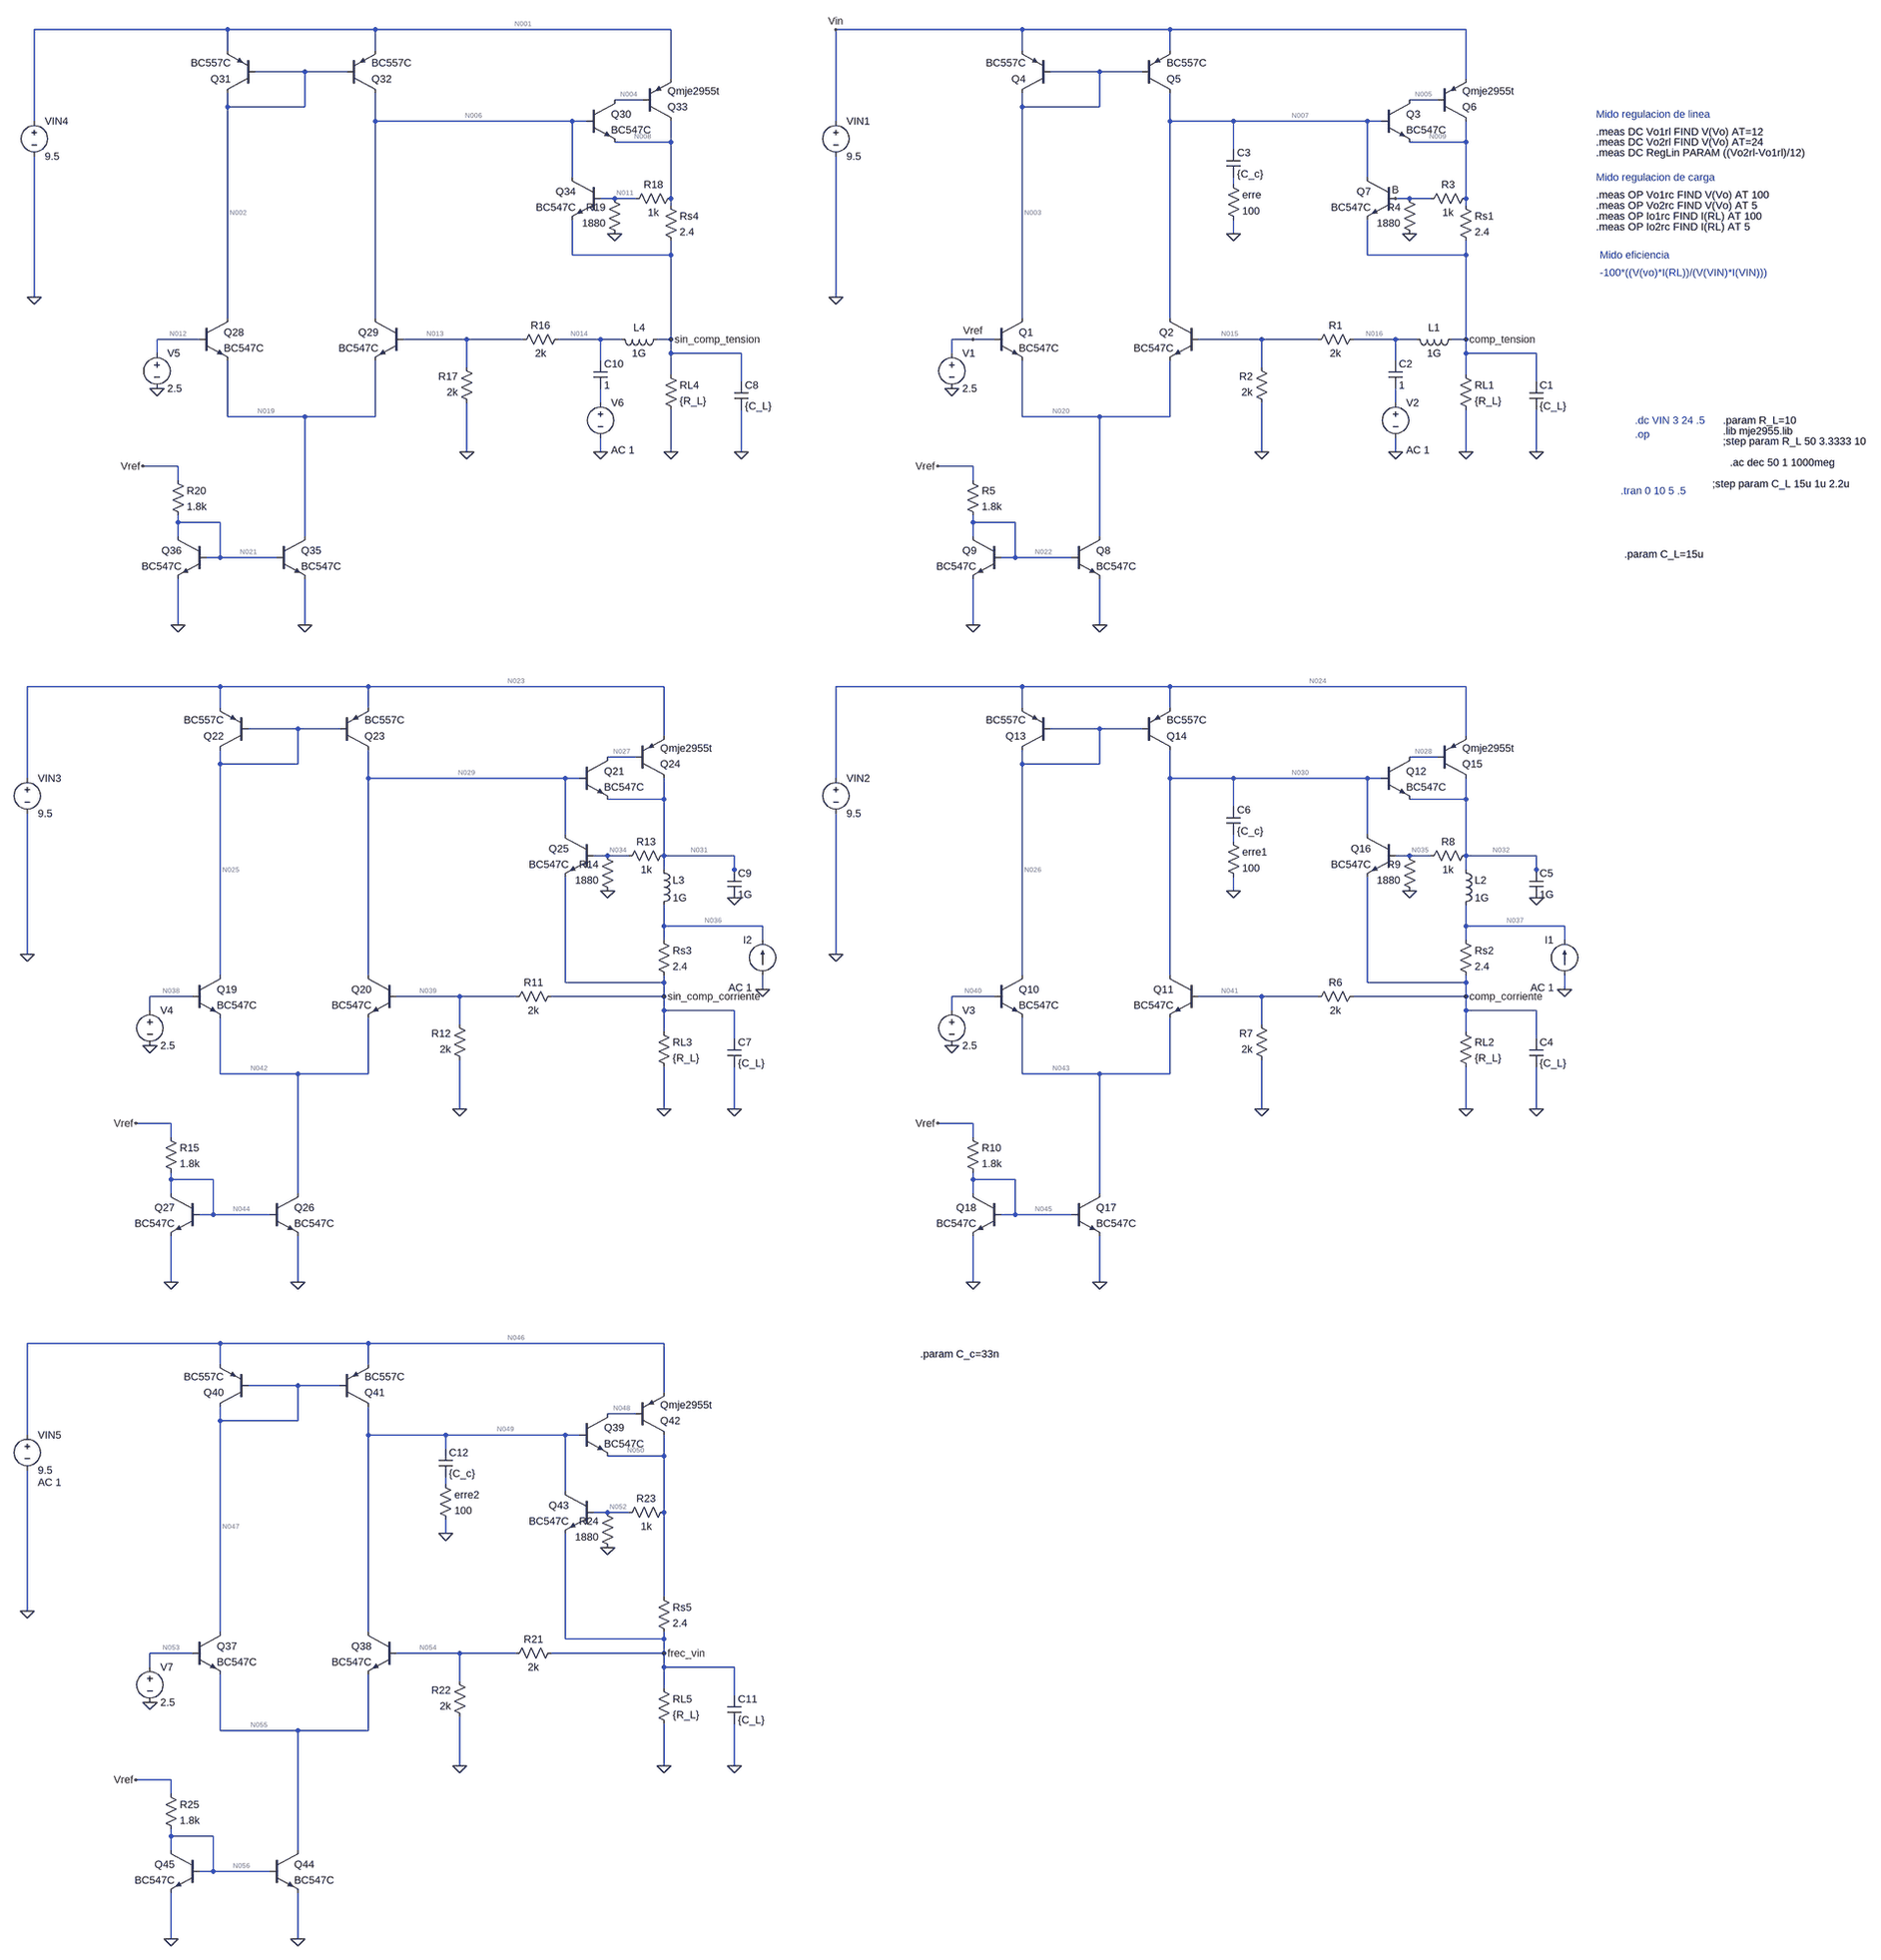
[diagram p0: schematic segundo_check_2.asc]
segundo_check_2.asc, the LTspice schematic file:
Version 4.1
SHEET 1 3652 4180
WIRE -2576 -384 -3088 -384
WIRE -2240 -384 -2576 -384
WIRE -1568 -384 -2240 -384
WIRE -528 -384 -1040 -384
WIRE -192 -384 -528 -384
WIRE 480 -384 -192 -384
WIRE -2576 -336 -2576 -384
WIRE -2240 -336 -2240 -384
WIRE -528 -336 -528 -384
WIRE -192 -336 -192 -384
WIRE -2400 -288 -2512 -288
WIRE -2304 -288 -2400 -288
WIRE -352 -288 -464 -288
WIRE -256 -288 -352 -288
WIRE -1568 -272 -1568 -384
WIRE 480 -272 480 -384
WIRE -1632 -224 -1696 -224
WIRE 416 -224 352 -224
WIRE -2576 -208 -2576 -240
WIRE -2400 -208 -2400 -288
WIRE -2400 -208 -2576 -208
WIRE -528 -208 -528 -240
WIRE -352 -208 -352 -288
WIRE -352 -208 -528 -208
WIRE -3088 -176 -3088 -384
WIRE -2240 -176 -2240 -240
WIRE -1792 -176 -2240 -176
WIRE -1760 -176 -1792 -176
WIRE -1040 -176 -1040 -384
WIRE -192 -176 -192 -240
WIRE -48 -176 -192 -176
WIRE 256 -176 -48 -176
WIRE 288 -176 256 -176
WIRE -1568 -128 -1568 -176
WIRE -1568 -128 -1696 -128
WIRE 480 -128 480 -176
WIRE 480 -128 352 -128
WIRE -48 -112 -48 -176
WIRE -1792 -48 -1792 -176
WIRE 256 -48 256 -176
WIRE -48 -32 -48 -48
WIRE -1696 0 -1728 0
WIRE -1648 0 -1696 0
WIRE -1568 0 -1568 -128
WIRE 352 0 320 0
WIRE 400 0 352 0
WIRE 480 0 480 -128
WIRE -1568 16 -1568 0
WIRE 480 16 480 0
WIRE -48 80 -48 48
WIRE -1792 128 -1792 48
WIRE -1568 128 -1568 96
WIRE -1568 128 -1792 128
WIRE 256 128 256 48
WIRE 480 128 480 96
WIRE 480 128 256 128
WIRE -3088 224 -3088 -96
WIRE -1040 224 -1040 -96
WIRE -2576 272 -2576 -208
WIRE -2240 272 -2240 -176
WIRE -528 272 -528 -208
WIRE -192 272 -192 -176
WIRE -2640 320 -2736 320
WIRE -2032 320 -2176 320
WIRE -1904 320 -2032 320
WIRE -1728 320 -1824 320
WIRE -1680 320 -1728 320
WIRE -1568 320 -1568 128
WIRE -1568 320 -1600 320
WIRE -640 320 -688 320
WIRE -592 320 -640 320
WIRE 16 320 -128 320
WIRE 144 320 16 320
WIRE 320 320 224 320
WIRE 368 320 320 320
WIRE 480 320 480 128
WIRE 480 320 448 320
WIRE -2736 352 -2736 320
WIRE -1568 352 -1568 320
WIRE -1408 352 -1568 352
WIRE -688 352 -688 320
WIRE 480 352 480 320
WIRE 640 352 480 352
WIRE -1728 368 -1728 320
WIRE 320 368 320 320
WIRE -2032 384 -2032 320
WIRE 16 384 16 320
WIRE -1568 400 -1568 352
WIRE 480 400 480 352
WIRE -1408 416 -1408 352
WIRE 640 416 640 352
WIRE -1728 464 -1728 432
WIRE 320 464 320 432
WIRE -2576 496 -2576 368
WIRE -2400 496 -2576 496
WIRE -2240 496 -2240 368
WIRE -2240 496 -2400 496
WIRE -528 496 -528 368
WIRE -352 496 -528 496
WIRE -192 496 -192 368
WIRE -192 496 -352 496
WIRE -2032 576 -2032 464
WIRE -1728 576 -1728 544
WIRE -1568 576 -1568 480
WIRE -1408 576 -1408 480
WIRE 16 576 16 464
WIRE 320 576 320 544
WIRE 480 576 480 480
WIRE 640 576 640 480
WIRE -2688 608 -2768 608
WIRE -640 608 -720 608
WIRE -2688 640 -2688 608
WIRE -640 640 -640 608
WIRE -2688 736 -2688 720
WIRE -2592 736 -2688 736
WIRE -640 736 -640 720
WIRE -544 736 -640 736
WIRE -2688 768 -2688 736
WIRE -2400 768 -2400 496
WIRE -640 768 -640 736
WIRE -352 768 -352 496
WIRE -2592 816 -2592 736
WIRE -2592 816 -2624 816
WIRE -2464 816 -2592 816
WIRE -544 816 -544 736
WIRE -544 816 -576 816
WIRE -416 816 -544 816
WIRE -2688 976 -2688 864
WIRE -2400 976 -2400 864
WIRE -640 976 -640 864
WIRE -352 976 -352 864
WIRE -2592 1216 -3104 1216
WIRE -2256 1216 -2592 1216
WIRE -1584 1216 -2256 1216
WIRE -528 1216 -1040 1216
WIRE -192 1216 -528 1216
WIRE 480 1216 -192 1216
WIRE -2592 1264 -2592 1216
WIRE -2256 1264 -2256 1216
WIRE -528 1264 -528 1216
WIRE -192 1264 -192 1216
WIRE -2416 1312 -2528 1312
WIRE -2320 1312 -2416 1312
WIRE -352 1312 -464 1312
WIRE -256 1312 -352 1312
WIRE -1584 1328 -1584 1216
WIRE 480 1328 480 1216
WIRE -1648 1376 -1712 1376
WIRE 416 1376 352 1376
WIRE -2592 1392 -2592 1360
WIRE -2416 1392 -2416 1312
WIRE -2416 1392 -2592 1392
WIRE -528 1392 -528 1360
WIRE -352 1392 -352 1312
WIRE -352 1392 -528 1392
WIRE -3104 1424 -3104 1216
WIRE -2256 1424 -2256 1360
WIRE -1808 1424 -2256 1424
WIRE -1776 1424 -1808 1424
WIRE -1040 1424 -1040 1216
WIRE -192 1424 -192 1360
WIRE -48 1424 -192 1424
WIRE 256 1424 -48 1424
WIRE 288 1424 256 1424
WIRE -1584 1472 -1584 1424
WIRE -1584 1472 -1712 1472
WIRE 480 1472 480 1424
WIRE 480 1472 352 1472
WIRE -48 1488 -48 1424
WIRE -1808 1552 -1808 1424
WIRE 256 1552 256 1424
WIRE -48 1568 -48 1552
WIRE -1712 1600 -1744 1600
WIRE -1664 1600 -1712 1600
WIRE -1584 1600 -1584 1472
WIRE -1424 1600 -1584 1600
WIRE 352 1600 320 1600
WIRE 400 1600 352 1600
WIRE 480 1600 480 1472
WIRE 640 1600 480 1600
WIRE -1584 1632 -1584 1600
WIRE -1424 1632 -1424 1600
WIRE 480 1632 480 1600
WIRE 640 1632 640 1600
WIRE -1424 1648 -1424 1632
WIRE 640 1648 640 1632
WIRE -48 1680 -48 1648
WIRE -1584 1760 -1584 1712
WIRE -1360 1760 -1584 1760
WIRE 480 1760 480 1712
WIRE 704 1760 480 1760
WIRE -1584 1792 -1584 1760
WIRE -1360 1792 -1360 1760
WIRE 480 1792 480 1760
WIRE 704 1792 704 1760
WIRE -3104 1824 -3104 1504
WIRE -1040 1824 -1040 1504
WIRE -2592 1872 -2592 1392
WIRE -2256 1872 -2256 1424
WIRE -528 1872 -528 1392
WIRE -192 1872 -192 1424
WIRE -1808 1888 -1808 1648
WIRE -1584 1888 -1584 1872
WIRE -1584 1888 -1808 1888
WIRE 256 1888 256 1648
WIRE 480 1888 480 1872
WIRE 480 1888 256 1888
WIRE -1360 1904 -1360 1872
WIRE 704 1904 704 1872
WIRE -2656 1920 -2752 1920
WIRE -2048 1920 -2192 1920
WIRE -1920 1920 -2048 1920
WIRE -1584 1920 -1584 1888
WIRE -1584 1920 -1840 1920
WIRE -592 1920 -688 1920
WIRE 16 1920 -128 1920
WIRE 144 1920 16 1920
WIRE 480 1920 480 1888
WIRE 480 1920 224 1920
WIRE -2752 1952 -2752 1920
WIRE -1584 1952 -1584 1920
WIRE -1424 1952 -1584 1952
WIRE -688 1952 -688 1920
WIRE 480 1952 480 1920
WIRE 640 1952 480 1952
WIRE -2048 1984 -2048 1920
WIRE 16 1984 16 1920
WIRE -1584 2000 -1584 1952
WIRE 480 2000 480 1952
WIRE -1424 2016 -1424 1952
WIRE 640 2016 640 1952
WIRE -2592 2096 -2592 1968
WIRE -2416 2096 -2592 2096
WIRE -2256 2096 -2256 1968
WIRE -2256 2096 -2416 2096
WIRE -528 2096 -528 1968
WIRE -352 2096 -528 2096
WIRE -192 2096 -192 1968
WIRE -192 2096 -352 2096
WIRE -2048 2176 -2048 2064
WIRE -1584 2176 -1584 2080
WIRE -1424 2176 -1424 2080
WIRE 16 2176 16 2064
WIRE 480 2176 480 2080
WIRE 640 2176 640 2080
WIRE -2704 2208 -2784 2208
WIRE -640 2208 -720 2208
WIRE -2704 2240 -2704 2208
WIRE -640 2240 -640 2208
WIRE -2704 2336 -2704 2320
WIRE -2608 2336 -2704 2336
WIRE -640 2336 -640 2320
WIRE -544 2336 -640 2336
WIRE -2704 2368 -2704 2336
WIRE -2416 2368 -2416 2096
WIRE -640 2368 -640 2336
WIRE -352 2368 -352 2096
WIRE -2608 2416 -2608 2336
WIRE -2608 2416 -2640 2416
WIRE -2480 2416 -2608 2416
WIRE -544 2416 -544 2336
WIRE -544 2416 -576 2416
WIRE -416 2416 -544 2416
WIRE -2704 2576 -2704 2464
WIRE -2416 2576 -2416 2464
WIRE -640 2576 -640 2464
WIRE -352 2576 -352 2464
WIRE -2592 2800 -3104 2800
WIRE -2256 2800 -2592 2800
WIRE -1584 2800 -2256 2800
WIRE -2592 2848 -2592 2800
WIRE -2256 2848 -2256 2800
WIRE -2416 2896 -2528 2896
WIRE -2320 2896 -2416 2896
WIRE -1584 2912 -1584 2800
WIRE -1648 2960 -1712 2960
WIRE -2592 2976 -2592 2944
WIRE -2416 2976 -2416 2896
WIRE -2416 2976 -2592 2976
WIRE -3104 3008 -3104 2800
WIRE -2256 3008 -2256 2944
WIRE -2080 3008 -2256 3008
WIRE -1808 3008 -2080 3008
WIRE -1776 3008 -1808 3008
WIRE -2080 3040 -2080 3008
WIRE -1584 3056 -1584 3008
WIRE -1584 3056 -1712 3056
WIRE -2080 3120 -2080 3104
WIRE -1808 3136 -1808 3008
WIRE -1712 3184 -1744 3184
WIRE -1664 3184 -1712 3184
WIRE -1584 3184 -1584 3056
WIRE -2080 3232 -2080 3200
WIRE -1584 3376 -1584 3184
WIRE -3104 3408 -3104 3088
WIRE -2592 3456 -2592 2976
WIRE -2256 3456 -2256 3008
WIRE -1808 3472 -1808 3232
WIRE -1584 3472 -1584 3456
WIRE -1584 3472 -1808 3472
WIRE -2656 3504 -2752 3504
WIRE -2048 3504 -2192 3504
WIRE -1920 3504 -2048 3504
WIRE -1584 3504 -1584 3472
WIRE -1584 3504 -1840 3504
WIRE -2752 3536 -2752 3504
WIRE -1584 3536 -1584 3504
WIRE -1424 3536 -1584 3536
WIRE -2048 3568 -2048 3504
WIRE -1584 3584 -1584 3536
WIRE -1424 3600 -1424 3536
WIRE -2592 3680 -2592 3552
WIRE -2416 3680 -2592 3680
WIRE -2256 3680 -2256 3552
WIRE -2256 3680 -2416 3680
WIRE -2048 3760 -2048 3648
WIRE -1584 3760 -1584 3664
WIRE -1424 3760 -1424 3664
WIRE -2704 3792 -2784 3792
WIRE -2704 3824 -2704 3792
WIRE -2704 3920 -2704 3904
WIRE -2608 3920 -2704 3920
WIRE -2704 3952 -2704 3920
WIRE -2416 3952 -2416 3680
WIRE -2608 4000 -2608 3920
WIRE -2608 4000 -2640 4000
WIRE -2480 4000 -2608 4000
WIRE -2704 4160 -2704 4048
WIRE -2416 4160 -2416 4048
FLAG -688 432 0
FLAG 480 576 0
FLAG -1040 224 0
FLAG 16 576 0
FLAG 352 80 0
FLAG 320 0 B
FLAG -640 320 Vref
FLAG -352 976 0
FLAG -1040 -384 Vin
FLAG -640 976 0
FLAG -720 608 Vref
FLAG 640 576 0
FLAG 320 576 0
FLAG -48 80 0
FLAG -688 2032 0
FLAG 480 2176 0
FLAG -1040 1824 0
FLAG 16 2176 0
FLAG 352 1680 0
FLAG -352 2576 0
FLAG -640 2576 0
FLAG -720 2208 Vref
FLAG 640 2176 0
FLAG 704 1904 0
FLAG -48 1680 0
FLAG 640 1696 0
FLAG -2752 2032 0
FLAG -1584 2176 0
FLAG -3104 1824 0
FLAG -2048 2176 0
FLAG -1712 1680 0
FLAG -2416 2576 0
FLAG -2704 2576 0
FLAG -2784 2208 Vref
FLAG -1424 2176 0
FLAG -1360 1904 0
FLAG -1424 1696 0
FLAG -2736 432 0
FLAG -1568 576 0
FLAG -3088 224 0
FLAG -2032 576 0
FLAG -1696 80 0
FLAG -2400 976 0
FLAG -2688 976 0
FLAG -2768 608 Vref
FLAG -1408 576 0
FLAG -1728 576 0
FLAG -1568 320 sin_comp_tension
FLAG 480 320 comp_tension
FLAG -1584 1920 sin_comp_corriente
FLAG 480 1920 comp_corriente
FLAG -2752 3616 0
FLAG -1584 3760 0
FLAG -3104 3408 0
FLAG -2048 3760 0
FLAG -1712 3264 0
FLAG -2416 4160 0
FLAG -2704 4160 0
FLAG -2784 3792 Vref
FLAG -1424 3760 0
FLAG -1584 3504 frec_vin
FLAG -2080 3232 0
SYMBOL npn -592 272 R0
SYMATTR InstName Q1
SYMATTR Value BC547C
SYMBOL npn -128 272 M0
SYMATTR InstName Q2
SYMATTR Value BC547C
SYMBOL npn 288 -224 R0
SYMATTR InstName Q3
SYMATTR Value BC547C
SYMBOL pnp -464 -240 R180
SYMATTR InstName Q4
SYMATTR Value BC557C
SYMBOL pnp -256 -240 M180
SYMATTR InstName Q5
SYMATTR Value BC557C
SYMBOL voltage -688 336 R0
WINDOW 123 24 124 Left 2
WINDOW 39 0 0 Left 0
SYMATTR InstName V1
SYMATTR Value 2.5
SYMBOL voltage -1040 -192 R0
WINDOW 123 0 0 Left 0
WINDOW 39 0 0 Left 0
SYMATTR InstName VIN1
SYMATTR Value 9.5
SYMBOL pnp 416 -176 M180
SYMATTR InstName Q6
SYMATTR Value Qmje2955t
SYMBOL res 464 384 R0
SYMATTR InstName RL1
SYMATTR Value {R_L}
SYMBOL res 240 304 R90
WINDOW 0 0 56 VBottom 2
WINDOW 3 32 56 VTop 2
SYMATTR InstName R1
SYMATTR Value 2k
SYMBOL res 32 480 R180
WINDOW 0 36 76 Left 2
WINDOW 3 36 40 Left 2
SYMATTR InstName R2
SYMATTR Value 2k
SYMBOL npn 320 -48 M0
SYMATTR InstName Q7
SYMATTR Value BC547C
SYMBOL res 464 0 R0
SYMATTR InstName Rs1
SYMATTR Value 2.4
SYMBOL res 496 -16 R90
WINDOW 0 0 56 VBottom 2
WINDOW 3 32 56 VTop 2
SYMATTR InstName R3
SYMATTR Value 1k
SYMBOL res 368 96 R180
WINDOW 0 36 76 Left 2
WINDOW 3 36 40 Left 2
SYMATTR InstName R4
SYMATTR Value 1880
SYMBOL npn -416 768 R0
SYMATTR InstName Q8
SYMATTR Value BC547C
SYMBOL npn -576 768 M0
SYMATTR InstName Q9
SYMATTR Value BC547C
SYMBOL res -656 624 R0
SYMATTR InstName R5
SYMATTR Value 1.8k
SYMBOL cap 624 416 R0
SYMATTR InstName C1
SYMATTR Value {C_L}
SYMBOL ind 464 304 R90
WINDOW 0 5 56 VBottom 2
WINDOW 3 32 56 VTop 2
SYMATTR InstName L1
SYMATTR Value 1G
SYMBOL cap 304 368 R0
SYMATTR InstName C2
SYMATTR Value 1
SYMBOL voltage 320 448 R0
WINDOW 123 24 124 Left 2
WINDOW 39 0 0 Left 0
SYMATTR Value2 AC 1
SYMATTR InstName V2
SYMATTR Value ""
SYMBOL cap -64 -112 R0
SYMATTR InstName C3
SYMATTR Value {C_c}
SYMBOL res -64 -48 R0
SYMATTR InstName erre
SYMATTR Value 100
SYMBOL npn -592 1872 R0
SYMATTR InstName Q10
SYMATTR Value BC547C
SYMBOL npn -128 1872 M0
SYMATTR InstName Q11
SYMATTR Value BC547C
SYMBOL npn 288 1376 R0
SYMATTR InstName Q12
SYMATTR Value BC547C
SYMBOL pnp -464 1360 R180
SYMATTR InstName Q13
SYMATTR Value BC557C
SYMBOL pnp -256 1360 M180
SYMATTR InstName Q14
SYMATTR Value BC557C
SYMBOL voltage -688 1936 R0
WINDOW 123 24 124 Left 2
WINDOW 39 0 0 Left 0
SYMATTR InstName V3
SYMATTR Value 2.5
SYMBOL voltage -1040 1408 R0
WINDOW 123 0 0 Left 0
WINDOW 39 0 0 Left 0
SYMATTR InstName VIN2
SYMATTR Value 9.5
SYMBOL pnp 416 1424 M180
SYMATTR InstName Q15
SYMATTR Value Qmje2955t
SYMBOL res 464 1984 R0
SYMATTR InstName RL2
SYMATTR Value {R_L}
SYMBOL res 240 1904 R90
WINDOW 0 0 56 VBottom 2
WINDOW 3 32 56 VTop 2
SYMATTR InstName R6
SYMATTR Value 2k
SYMBOL res 32 2080 R180
WINDOW 0 36 76 Left 2
WINDOW 3 36 40 Left 2
SYMATTR InstName R7
SYMATTR Value 2k
SYMBOL npn 320 1552 M0
SYMATTR InstName Q16
SYMATTR Value BC547C
SYMBOL res 464 1776 R0
SYMATTR InstName Rs2
SYMATTR Value 2.4
SYMBOL res 496 1584 R90
WINDOW 0 0 56 VBottom 2
WINDOW 3 32 56 VTop 2
SYMATTR InstName R8
SYMATTR Value 1k
SYMBOL res 368 1696 R180
WINDOW 0 36 76 Left 2
WINDOW 3 36 40 Left 2
SYMATTR InstName R9
SYMATTR Value 1880
SYMBOL npn -416 2368 R0
SYMATTR InstName Q17
SYMATTR Value BC547C
SYMBOL npn -576 2368 M0
SYMATTR InstName Q18
SYMATTR Value BC547C
SYMBOL res -656 2224 R0
SYMATTR InstName R10
SYMATTR Value 1.8k
SYMBOL cap 624 2016 R0
SYMATTR InstName C4
SYMATTR Value {C_L}
SYMBOL ind 464 1616 R0
SYMATTR InstName L2
SYMATTR Value 1G
SYMBOL cap -64 1488 R0
SYMATTR InstName C6
SYMATTR Value {C_c}
SYMBOL res -64 1552 R0
SYMATTR InstName erre1
SYMATTR Value 100
SYMBOL current 704 1872 R180
WINDOW 0 24 80 Left 2
WINDOW 3 24 0 Left 2
WINDOW 123 24 -28 Left 2
WINDOW 39 0 0 Left 0
SYMATTR InstName I1
SYMATTR Value ""
SYMATTR Value2 AC 1
SYMBOL cap 624 1632 R0
SYMATTR InstName C5
SYMATTR Value 1G
SYMBOL npn -2656 1872 R0
SYMATTR InstName Q19
SYMATTR Value BC547C
SYMBOL npn -2192 1872 M0
SYMATTR InstName Q20
SYMATTR Value BC547C
SYMBOL npn -1776 1376 R0
SYMATTR InstName Q21
SYMATTR Value BC547C
SYMBOL pnp -2528 1360 R180
SYMATTR InstName Q22
SYMATTR Value BC557C
SYMBOL pnp -2320 1360 M180
SYMATTR InstName Q23
SYMATTR Value BC557C
SYMBOL voltage -2752 1936 R0
WINDOW 123 24 124 Left 2
WINDOW 39 0 0 Left 0
SYMATTR InstName V4
SYMATTR Value 2.5
SYMBOL voltage -3104 1408 R0
WINDOW 123 0 0 Left 0
WINDOW 39 0 0 Left 0
SYMATTR InstName VIN3
SYMATTR Value 9.5
SYMBOL pnp -1648 1424 M180
SYMATTR InstName Q24
SYMATTR Value Qmje2955t
SYMBOL res -1600 1984 R0
SYMATTR InstName RL3
SYMATTR Value {R_L}
SYMBOL res -1824 1904 R90
WINDOW 0 0 56 VBottom 2
WINDOW 3 32 56 VTop 2
SYMATTR InstName R11
SYMATTR Value 2k
SYMBOL res -2032 2080 R180
WINDOW 0 36 76 Left 2
WINDOW 3 36 40 Left 2
SYMATTR InstName R12
SYMATTR Value 2k
SYMBOL npn -1744 1552 M0
SYMATTR InstName Q25
SYMATTR Value BC547C
SYMBOL res -1600 1776 R0
SYMATTR InstName Rs3
SYMATTR Value 2.4
SYMBOL res -1568 1584 R90
WINDOW 0 0 56 VBottom 2
WINDOW 3 32 56 VTop 2
SYMATTR InstName R13
SYMATTR Value 1k
SYMBOL res -1696 1696 R180
WINDOW 0 36 76 Left 2
WINDOW 3 36 40 Left 2
SYMATTR InstName R14
SYMATTR Value 1880
SYMBOL npn -2480 2368 R0
SYMATTR InstName Q26
SYMATTR Value BC547C
SYMBOL npn -2640 2368 M0
SYMATTR InstName Q27
SYMATTR Value BC547C
SYMBOL res -2720 2224 R0
SYMATTR InstName R15
SYMATTR Value 1.8k
SYMBOL cap -1440 2016 R0
SYMATTR InstName C7
SYMATTR Value {C_L}
SYMBOL ind -1600 1616 R0
SYMATTR InstName L3
SYMATTR Value 1G
SYMBOL current -1360 1872 R180
WINDOW 0 24 80 Left 2
WINDOW 3 24 0 Left 2
WINDOW 123 24 -28 Left 2
WINDOW 39 0 0 Left 0
SYMATTR InstName I2
SYMATTR Value ""
SYMATTR Value2 AC 1
SYMBOL cap -1440 1632 R0
SYMATTR InstName C9
SYMATTR Value 1G
SYMBOL npn -2640 272 R0
SYMATTR InstName Q28
SYMATTR Value BC547C
SYMBOL npn -2176 272 M0
SYMATTR InstName Q29
SYMATTR Value BC547C
SYMBOL npn -1760 -224 R0
SYMATTR InstName Q30
SYMATTR Value BC547C
SYMBOL pnp -2512 -240 R180
SYMATTR InstName Q31
SYMATTR Value BC557C
SYMBOL pnp -2304 -240 M180
SYMATTR InstName Q32
SYMATTR Value BC557C
SYMBOL voltage -2736 336 R0
WINDOW 123 24 124 Left 2
WINDOW 39 0 0 Left 0
SYMATTR InstName V5
SYMATTR Value 2.5
SYMBOL voltage -3088 -192 R0
WINDOW 123 0 0 Left 0
WINDOW 39 0 0 Left 0
SYMATTR InstName VIN4
SYMATTR Value 9.5
SYMBOL pnp -1632 -176 M180
SYMATTR InstName Q33
SYMATTR Value Qmje2955t
SYMBOL res -1584 384 R0
SYMATTR InstName RL4
SYMATTR Value {R_L}
SYMBOL res -1808 304 R90
WINDOW 0 0 56 VBottom 2
WINDOW 3 32 56 VTop 2
SYMATTR InstName R16
SYMATTR Value 2k
SYMBOL res -2016 480 R180
WINDOW 0 36 76 Left 2
WINDOW 3 36 40 Left 2
SYMATTR InstName R17
SYMATTR Value 2k
SYMBOL npn -1728 -48 M0
SYMATTR InstName Q34
SYMATTR Value BC547C
SYMBOL res -1584 0 R0
SYMATTR InstName Rs4
SYMATTR Value 2.4
SYMBOL res -1552 -16 R90
WINDOW 0 0 56 VBottom 2
WINDOW 3 32 56 VTop 2
SYMATTR InstName R18
SYMATTR Value 1k
SYMBOL res -1680 96 R180
WINDOW 0 36 76 Left 2
WINDOW 3 36 40 Left 2
SYMATTR InstName R19
SYMATTR Value 1880
SYMBOL npn -2464 768 R0
SYMATTR InstName Q35
SYMATTR Value BC547C
SYMBOL npn -2624 768 M0
SYMATTR InstName Q36
SYMATTR Value BC547C
SYMBOL res -2704 624 R0
SYMATTR InstName R20
SYMATTR Value 1.8k
SYMBOL cap -1424 416 R0
SYMATTR InstName C8
SYMATTR Value {C_L}
SYMBOL ind -1584 304 R90
WINDOW 0 5 56 VBottom 2
WINDOW 3 32 56 VTop 2
SYMATTR InstName L4
SYMATTR Value 1G
SYMBOL cap -1744 368 R0
SYMATTR InstName C10
SYMATTR Value 1
SYMBOL voltage -1728 448 R0
WINDOW 123 24 124 Left 2
WINDOW 39 0 0 Left 0
SYMATTR Value2 AC 1
SYMATTR InstName V6
SYMATTR Value ""
SYMBOL npn -2656 3456 R0
SYMATTR InstName Q37
SYMATTR Value BC547C
SYMBOL npn -2192 3456 M0
SYMATTR InstName Q38
SYMATTR Value BC547C
SYMBOL npn -1776 2960 R0
SYMATTR InstName Q39
SYMATTR Value BC547C
SYMBOL pnp -2528 2944 R180
SYMATTR InstName Q40
SYMATTR Value BC557C
SYMBOL pnp -2320 2944 M180
SYMATTR InstName Q41
SYMATTR Value BC557C
SYMBOL voltage -2752 3520 R0
WINDOW 123 24 124 Left 2
WINDOW 39 0 0 Left 0
SYMATTR InstName V7
SYMATTR Value 2.5
SYMBOL voltage -3104 2992 R0
WINDOW 123 24 124 Left 2
WINDOW 39 0 0 Left 0
SYMATTR Value2 AC 1
SYMATTR InstName VIN5
SYMATTR Value 9.5
SYMBOL pnp -1648 3008 M180
SYMATTR InstName Q42
SYMATTR Value Qmje2955t
SYMBOL res -1600 3568 R0
SYMATTR InstName RL5
SYMATTR Value {R_L}
SYMBOL res -1824 3488 R90
WINDOW 0 0 56 VBottom 2
WINDOW 3 32 56 VTop 2
SYMATTR InstName R21
SYMATTR Value 2k
SYMBOL res -2032 3664 R180
WINDOW 0 36 76 Left 2
WINDOW 3 36 40 Left 2
SYMATTR InstName R22
SYMATTR Value 2k
SYMBOL npn -1744 3136 M0
SYMATTR InstName Q43
SYMATTR Value BC547C
SYMBOL res -1600 3360 R0
SYMATTR InstName Rs5
SYMATTR Value 2.4
SYMBOL res -1568 3168 R90
WINDOW 0 0 56 VBottom 2
WINDOW 3 32 56 VTop 2
SYMATTR InstName R23
SYMATTR Value 1k
SYMBOL res -1696 3280 R180
WINDOW 0 36 76 Left 2
WINDOW 3 36 40 Left 2
SYMATTR InstName R24
SYMATTR Value 1880
SYMBOL npn -2480 3952 R0
SYMATTR InstName Q44
SYMATTR Value BC547C
SYMBOL npn -2640 3952 M0
SYMATTR InstName Q45
SYMATTR Value BC547C
SYMBOL res -2720 3808 R0
SYMATTR InstName R25
SYMATTR Value 1.8k
SYMBOL cap -1440 3600 R0
SYMATTR InstName C11
SYMATTR Value {C_L}
SYMBOL cap -2096 3040 R0
SYMATTR InstName C12
SYMATTR Value {C_c}
SYMBOL res -2096 3104 R0
SYMATTR InstName erre2
SYMATTR Value 100
TEXT 1064 504 Left 2 !.param R_L=10
TEXT 1064 528 Left 2 !.lib mje2955.lib
TEXT 864 504 Left 2 ;.dc VIN 3 24 .5
TEXT 1064 552 Left 2 !;step param R_L 50 3.3333 10
TEXT 864 536 Left 2 ;.op
TEXT 776 -192 Left 2 ;Mido regulacion de linea
TEXT 776 -152 Left 2 !.meas DC Vo1rl FIND V(Vo) AT=12
TEXT 776 -128 Left 2 !.meas DC Vo2rl FIND V(Vo) AT=24
TEXT 776 -104 Left 2 !.meas DC RegLin PARAM ((Vo2rl-Vo1rl)/12)
TEXT 776 -48 Left 2 ;Mido regulacion de carga
TEXT 776 -8 Left 2 !.meas OP Vo1rc FIND V(Vo) AT 100
TEXT 776 16 Left 2 !.meas OP Vo2rc FIND V(Vo) AT 5
TEXT 776 40 Left 2 !.meas OP Io1rc FIND I(RL) AT 100
TEXT 776 64 Left 2 !.meas OP Io2rc FIND I(RL) AT 5
TEXT 784 128 Left 2 ;Mido eficiencia
TEXT 784 168 Left 2 ;-100*((V(vo)*I(RL))/(V(VIN)*I(VIN)))
TEXT 832 664 Left 2 ;.tran 0 10 5 .5
TEXT 1080 600 Left 2 !.ac dec 50 1 1000meg
TEXT 1040 648 Left 2 !;step param C_L 15u 1u 2.2u
TEXT 840 808 Left 2 !.param C_L=15u
TEXT -760 2824 Left 2 !.param C_c=33n

The netlist it stands for:
* segundo_check_2.asc
Q1 N003 Vref N020 0 BC547C
Q2 N007 N015 N020 0 BC547C
Q3 N005 N007 N009 0 BC547C
Q4 N003 N003 Vin 0 BC557C
Q5 N007 N003 Vin 0 BC557C
V1 Vref 0 2.5
VIN1 Vin 0 9.5
Q6 N009 N005 Vin 0 Qmje2955t
RL1 comp_tension 0 {R_L}
R1 N016 N015 2k
R2 0 N015 2k
Q7 N007 B comp_tension 0 BC547C
Rs1 N009 comp_tension 2.4
R3 N009 B 1k
R4 0 B 1880
Q8 N020 N022 0 0 BC547C
Q9 N022 N022 0 0 BC547C
R5 Vref N022 1.8k
C1 comp_tension 0 {C_L}
L1 comp_tension N016 1G
C2 N016 N018 1
V2 N018 0 AC 1
C3 N007 N010 {C_c}
R§erre N010 0 100
Q10 N026 N040 N043 0 BC547C
Q11 N030 N041 N043 0 BC547C
Q12 N028 N030 N032 0 BC547C
Q13 N026 N026 N024 0 BC557C
Q14 N030 N026 N024 0 BC557C
V3 N040 0 2.5
VIN2 N024 0 9.5
Q15 N032 N028 N024 0 Qmje2955t
RL2 comp_corriente 0 {R_L}
R6 comp_corriente N041 2k
R7 0 N041 2k
Q16 N030 N035 comp_corriente 0 BC547C
Rs2 N037 comp_corriente 2.4
R8 N032 N035 1k
R9 0 N035 1880
Q17 N043 N045 0 0 BC547C
Q18 N045 N045 0 0 BC547C
R10 Vref N045 1.8k
C4 comp_corriente 0 {C_L}
L2 N032 N037 1G
C6 N030 N033 {C_c}
R§erre1 N033 0 100
I1 0 N037 AC 1
C5 N032 0 1G
Q19 N025 N038 N042 0 BC547C
Q20 N029 N039 N042 0 BC547C
Q21 N027 N029 N031 0 BC547C
Q22 N025 N025 N023 0 BC557C
Q23 N029 N025 N023 0 BC557C
V4 N038 0 2.5
VIN3 N023 0 9.5
Q24 N031 N027 N023 0 Qmje2955t
RL3 sin_comp_corriente 0 {R_L}
R11 sin_comp_corriente N039 2k
R12 0 N039 2k
Q25 N029 N034 sin_comp_corriente 0 BC547C
Rs3 N036 sin_comp_corriente 2.4
R13 N031 N034 1k
R14 0 N034 1880
Q26 N042 N044 0 0 BC547C
Q27 N044 N044 0 0 BC547C
R15 Vref N044 1.8k
C7 sin_comp_corriente 0 {C_L}
L3 N031 N036 1G
I2 0 N036 AC 1
C9 N031 0 1G
Q28 N002 N012 N019 0 BC547C
Q29 N006 N013 N019 0 BC547C
Q30 N004 N006 N008 0 BC547C
Q31 N002 N002 N001 0 BC557C
Q32 N006 N002 N001 0 BC557C
V5 N012 0 2.5
VIN4 N001 0 9.5
Q33 N008 N004 N001 0 Qmje2955t
RL4 sin_comp_tension 0 {R_L}
R16 N014 N013 2k
R17 0 N013 2k
Q34 N006 N011 sin_comp_tension 0 BC547C
Rs4 N008 sin_comp_tension 2.4
R18 N008 N011 1k
R19 0 N011 1880
Q35 N019 N021 0 0 BC547C
Q36 N021 N021 0 0 BC547C
R20 Vref N021 1.8k
C8 sin_comp_tension 0 {C_L}
L4 sin_comp_tension N014 1G
C10 N014 N017 1
V6 N017 0 AC 1
Q37 N047 N053 N055 0 BC547C
Q38 N049 N054 N055 0 BC547C
Q39 N048 N049 N050 0 BC547C
Q40 N047 N047 N046 0 BC557C
Q41 N049 N047 N046 0 BC557C
V7 N053 0 2.5
VIN5 N046 0 9.5 AC 1
Q42 N050 N048 N046 0 Qmje2955t
RL5 frec_vin 0 {R_L}
R21 frec_vin N054 2k
R22 0 N054 2k
Q43 N049 N052 frec_vin 0 BC547C
Rs5 N050 frec_vin 2.4
R23 N050 N052 1k
R24 0 N052 1880
Q44 N055 N056 0 0 BC547C
Q45 N056 N056 0 0 BC547C
R25 Vref N056 1.8k
C11 frec_vin 0 {C_L}
C12 N049 N051 {C_c}
R§erre2 N051 0 100
.model NPN NPN
.model PNP PNP
.lib standard.bjt
.param R_L=10
.lib mje2955.lib
* .dc VIN 3 24 .5
;step param R_L 50 3.3333 10
* .op
* Mido regulacion de linea
.meas DC Vo1rl FIND V(Vo) AT=12
.meas DC Vo2rl FIND V(Vo) AT=24
.meas DC RegLin PARAM ((Vo2rl-Vo1rl)/12)
* Mido regulacion de carga
.meas OP Vo1rc FIND V(Vo) AT 100
.meas OP Vo2rc FIND V(Vo) AT 5
.meas OP Io1rc FIND I(RL) AT 100
.meas OP Io2rc FIND I(RL) AT 5
* Mido eficiencia
* -100*((V(vo)*I(RL))/(V(VIN)*I(VIN)))
* .tran 0 10 5 .5
.ac dec 50 1 1000meg
;step param C_L 15u 1u 2.2u
.param C_L=15u
.param C_c=33n
.backanno
.end

* Results of the author's LTspice run, read from the files saved beside the schematic
* Operating Point, zero values left out:
*   V(n015) = 2.502 V
*   V(n030) = 6.874 V
*   V(n045) = 622.9 mV
*   V(n031) = 6.212 V
*   V(n044) = 622.9 mV
*   V(n001) = 9.5 V
*   V(n046) = 9.5 V
*   V(vref) = 2.5 V
*   V(n016) = 5.007 V
*   V(comp_corriente) = 5.007 V
*   V(n029) = 6.874 V
*   V(sin_comp_corriente) = 5.007 V
*   V(n013) = 2.502 V
*   V(n054) = 2.502 V
*   V(n009) = 6.212 V
*   V(n026) = 8.9 V
*   V(n028) = 8.944 V
*   V(n025) = 8.9 V
*   V(n012) = 2.5 V
*   V(n014) = 5.007 V
*   V(n053) = 2.5 V
*   V(n052) = 4.055 V
*   V(n007) = 6.873 V
*   V(n022) = 622.9 mV
*   V(n037) = 6.212 V
*   V(n027) = 8.944 V
*   V(n036) = 6.212 V
*   V(n008) = 6.212 V
*   V(n050) = 6.212 V
*   V(n042) = 1.899 V
*   V(n003) = 8.9 V
*   V(comp_tension) = 5.007 V
*   V(n043) = 1.899 V
*   V(n024) = 9.5 V
*   V(n006) = 6.873 V
*   V(n021) = 622.9 mV
*   V(n049) = 6.873 V
*   V(n005) = 8.945 V
*   V(n041) = 2.502 V
*   V(n023) = 9.5 V
*   V(n002) = 8.9 V
*   V(sin_comp_tension) = 5.007 V
*   V(frec_vin) = 5.007 V
*   V(n020) = 1.899 V
*   V(b) = 4.055 V
*   V(n035) = 4.055 V
*   V(n039) = 2.502 V
*   V(n034) = 4.055 V
*   V(n004) = 8.945 V
*   V(n047) = 8.9 V
*   V(n048) = 8.945 V
*   V(n038) = 2.5 V
*   V(vin) = 9.5 V
*   V(n040) = 2.5 V
*   V(n032) = 6.212 V
*   V(n019) = 1.899 V
*   V(n011) = 4.055 V
*   V(n055) = 1.899 V
*   V(n056) = 622.9 mV
*   I(R3) = 2.157 mA
*   I(R7) = -1.251 mA
*   I(C5) = 6.212 mA
*   Ic(Q1) = 514.9 µA
*   Ib(Q1) = 1.012 µA
*   Ie(Q1) = -515.9 µA
*   I(R22) = -1.251 mA
*   I(L4) = 1.252 mA
*   Ic(Q34) = 2.847 pA
*   Ib(Q34) = -3.8 pA
*   Ic(Q17) = 1.063 mA
*   Ib(Q17) = 2.295 µA
*   Ie(Q17) = -1.066 mA
*   Ic(Q12) = 4.506 mA
*   Ib(Q12) = 9.797 µA
*   Ie(Q12) = -4.516 mA
*   I(V1) = -5.215 mA
*   Ic(Q31) = -512.6 µA
*   Ib(Q31) = -1.153 µA
*   Ie(Q31) = 513.7 µA
*   I(Rs3) = 502 mA
*   Ic(Q39) = 4.443 mA
*   Ib(Q39) = 9.654 µA
*   Ie(Q39) = -4.452 mA
*   Ic(Q15) = -505.8 mA
*   Ib(Q15) = -4.506 mA
*   Ie(Q15) = 510.3 mA
*   I(R15) = 1.043 mA
*   I(R2) = -1.251 mA
*   Ic(Q23) = -555.9 µA
*   Ib(Q23) = -1.152 µA
*   Ie(Q23) = 557.1 µA
*   Ic(Q42) = -499.7 mA
*   Ib(Q42) = -4.443 mA
*   Ie(Q42) = 504.1 mA
*   Ic(Q44) = 1.063 mA
*   Ib(Q44) = 2.295 µA
*   Ie(Q44) = -1.066 mA
*   Ic(Q36) = 1.038 mA
*   Ib(Q36) = 2.295 µA
*   Ie(Q36) = -1.041 mA
*   I(RL4) = 500.7 mA
*   I(R11) = 1.252 mA
*   Ic(Q3) = 4.443 mA
*   Ib(Q3) = 9.654 µA
*   Ie(Q3) = -4.452 mA
*   I(Rs2) = 502 mA
*   I(V6) = 5.007 pA
*   Ic(Q20) = 546.1 µA
*   Ib(Q20) = 1.112 µA
*   Ie(Q20) = -547.2 µA
*   Ic(Q14) = -555.9 µA
*   Ib(Q14) = -1.152 µA
*   Ie(Q14) = 557.1 µA
*   I(R18) = 2.157 mA
*   Ic(Q8) = 1.063 mA
*   Ib(Q8) = 2.295 µA
*   Ie(Q8) = -1.066 mA
*   Ic(Q28) = 514.9 µA
*   Ib(Q28) = 1.012 µA
*   Ie(Q28) = -515.9 µA
*   I(Rs5) = 502 mA
*   Ic(Q41) = -555.9 µA
*   Ib(Q41) = -1.152 µA
*   Ie(Q41) = 557 µA
*   I(V5) = -1.012 µA
*   I(R14) = -2.157 mA
*   I(R25) = 1.043 mA
*   I(R10) = 1.043 mA
*   I(VIN3) = -511.4 mA
*   Ic(Q6) = -499.7 mA
*   Ib(Q6) = -4.443 mA
*   Ie(Q6) = 504.1 mA
*   I(C2) = 5.007 pA
*   I(Rs1) = 502 mA
*   I(R6) = 1.252 mA
*   I(R21) = 1.252 mA
*   I(L3) = 502 mA
*   Ic(Q11) = 546.1 µA
*   Ib(Q11) = 1.112 µA
*   Ie(Q11) = -547.2 µA
*   Ic(Q38) = 546.2 µA
*   Ib(Q38) = 1.112 µA
*   Ie(Q38) = -547.3 µA
*   Ic(Q5) = -555.9 µA
*   Ib(Q5) = -1.152 µA
*   Ie(Q5) = 557 µA
*   I(R9) = -2.157 mA
*   Ic(Q30) = 4.443 mA
*   Ib(Q30) = 9.654 µA
*   Ie(Q30) = -4.452 mA
*   Ic(Q25) = 2.847 pA
*   Ib(Q25) = -3.801 pA
*   I(R17) = -1.251 mA
*   I(R5) = 1.043 mA
*   I(R24) = -2.157 mA
*   Ic(Q35) = 1.063 mA
*   Ib(Q35) = 2.295 µA
*   Ie(Q35) = -1.066 mA
*   I(R1) = 1.252 mA
*   Ic(Q27) = 1.038 mA
*   Ib(Q27) = 2.295 µA
*   Ie(Q27) = -1.041 mA
*   Ic(Q22) = -512.6 µA
*   Ib(Q22) = -1.153 µA
*   Ie(Q22) = 513.8 µA
*   I(VIN2) = -511.4 mA
*   I(L2) = 502 mA
*   Ic(Q33) = -499.7 mA
*   Ib(Q33) = -4.443 mA
*   Ie(Q33) = 504.1 mA
*   Ic(Q2) = 546.2 µA
*   Ib(Q2) = 1.112 µA
*   Ie(Q2) = -547.3 µA
*   I(VIN5) = -505.2 mA
*   I(C10) = 5.007 pA
*   I(RL3) = 500.7 mA
*   I(Rs4) = 502 mA
*   Ic(Q13) = -512.6 µA
*   Ib(Q13) = -1.153 µA
*   Ie(Q13) = 513.8 µA
*   Ic(Q43) = 2.846 pA
*   Ib(Q43) = -3.8 pA
*   I(R4) = -2.157 mA
*   I(C9) = 6.212 mA
*   Ic(Q16) = 2.847 pA
*   Ib(Q16) = -3.801 pA
*   Ic(Q19) = 515 µA
*   Ib(Q19) = 1.012 µA
*   Ie(Q19) = -516 µA
*   I(R13) = 2.157 mA
*   Ic(Q40) = -512.6 µA
*   Ib(Q40) = -1.153 µA
*   Ie(Q40) = 513.7 µA
*   I(VIN1) = -505.2 mA
*   Ic(Q32) = -555.9 µA
*   Ib(Q32) = -1.152 µA
*   Ie(Q32) = 557 µA
*   I(L1) = 1.252 mA
*   Ic(Q18) = 1.038 mA
*   Ib(Q18) = 2.295 µA
*   Ie(Q18) = -1.041 mA
*   Ic(Q45) = 1.038 mA
*   Ib(Q45) = 2.295 µA
*   Ie(Q45) = -1.041 mA
*   I(R20) = 1.043 mA
*   I(RL2) = 500.7 mA
*   Ic(Q7) = 2.846 pA
*   Ib(Q7) = -3.801 pA
*   I(V4) = -1.012 µA
*   I(RL5) = 500.7 mA
*   I(R12) = -1.251 mA
*   I(R8) = 2.157 mA
*   Ic(Q10) = 515 µA
*   Ib(Q10) = 1.012 µA
*   Ie(Q10) = -516 µA
*   Ic(Q4) = -512.6 µA
*   Ib(Q4) = -1.153 µA
*   Ie(Q4) = 513.7 µA
*   I(R16) = 1.252 mA
*   Ic(Q37) = 514.9 µA
*   Ib(Q37) = 1.012 µA
*   Ie(Q37) = -515.9 µA
*   I(R23) = 2.157 mA
*   Ic(Q9) = 1.038 mA
*   Ib(Q9) = 2.295 µA
*   Ie(Q9) = -1.041 mA
*   Ic(Q26) = 1.063 mA
*   Ib(Q26) = 2.295 µA
*   Ie(Q26) = -1.066 mA
*   Ic(Q21) = 4.506 mA
*   Ib(Q21) = 9.797 µA
*   Ie(Q21) = -4.516 mA
*   I(V3) = -1.012 µA
*   I(R19) = -2.157 mA
*   Ic(Q29) = 546.2 µA
*   Ib(Q29) = 1.112 µA
*   Ie(Q29) = -547.3 µA
*   Ic(Q24) = -505.8 mA
*   Ib(Q24) = -4.506 mA
*   Ie(Q24) = 510.3 mA
*   I(V7) = -1.012 µA
*   I(RL1) = 500.7 mA
*   I(V2) = 5.007 pA
*   I(VIN4) = -505.2 mA
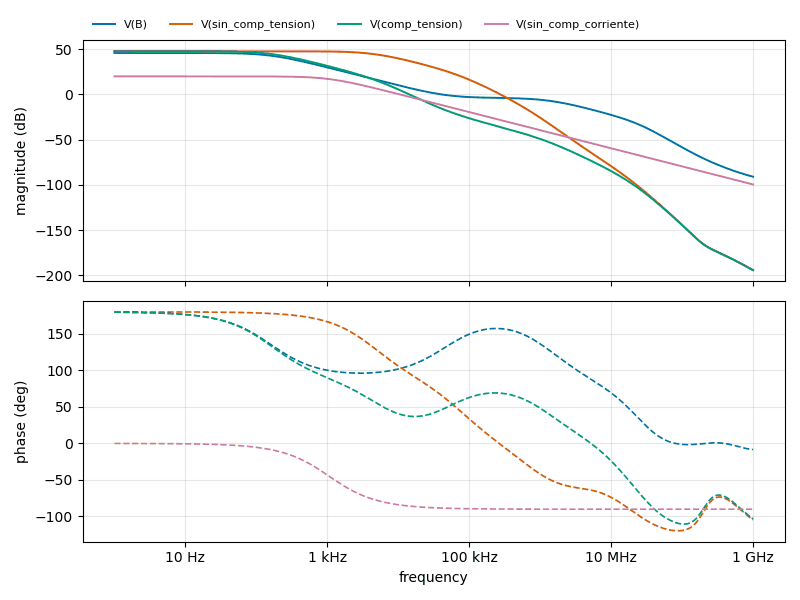
[diagram p1: AC Analysis of segundo_check_2.asc, plotted from the saved traces]
* AC Analysis, 1 run:
*   V(B): 45.86 dB at 1 Hz, -90.88 dB at 1 GHz, peak 45.86 dB at 1 Hz, 3 dB below the peak at 160.9 Hz
*   V(sin_comp_tension): 47.70 dB at 1 Hz, -194.08 dB at 1 GHz, peak 47.70 dB at 1 Hz, 3 dB below the peak at 4.435 kHz
*   V(comp_tension): 47.70 dB at 1 Hz, -194.20 dB at 1 GHz, peak 47.70 dB at 1 Hz, 3 dB below the peak at 160.7 Hz
*   V(sin_comp_corriente): 19.98 dB at 1 Hz, -99.49 dB at 1 GHz, peak 19.98 dB at 1 Hz, 3 dB below the peak at 1.063 kHz